# EAGLE schematic Avionis_Final_v19 (EAGLE 9.7.0)
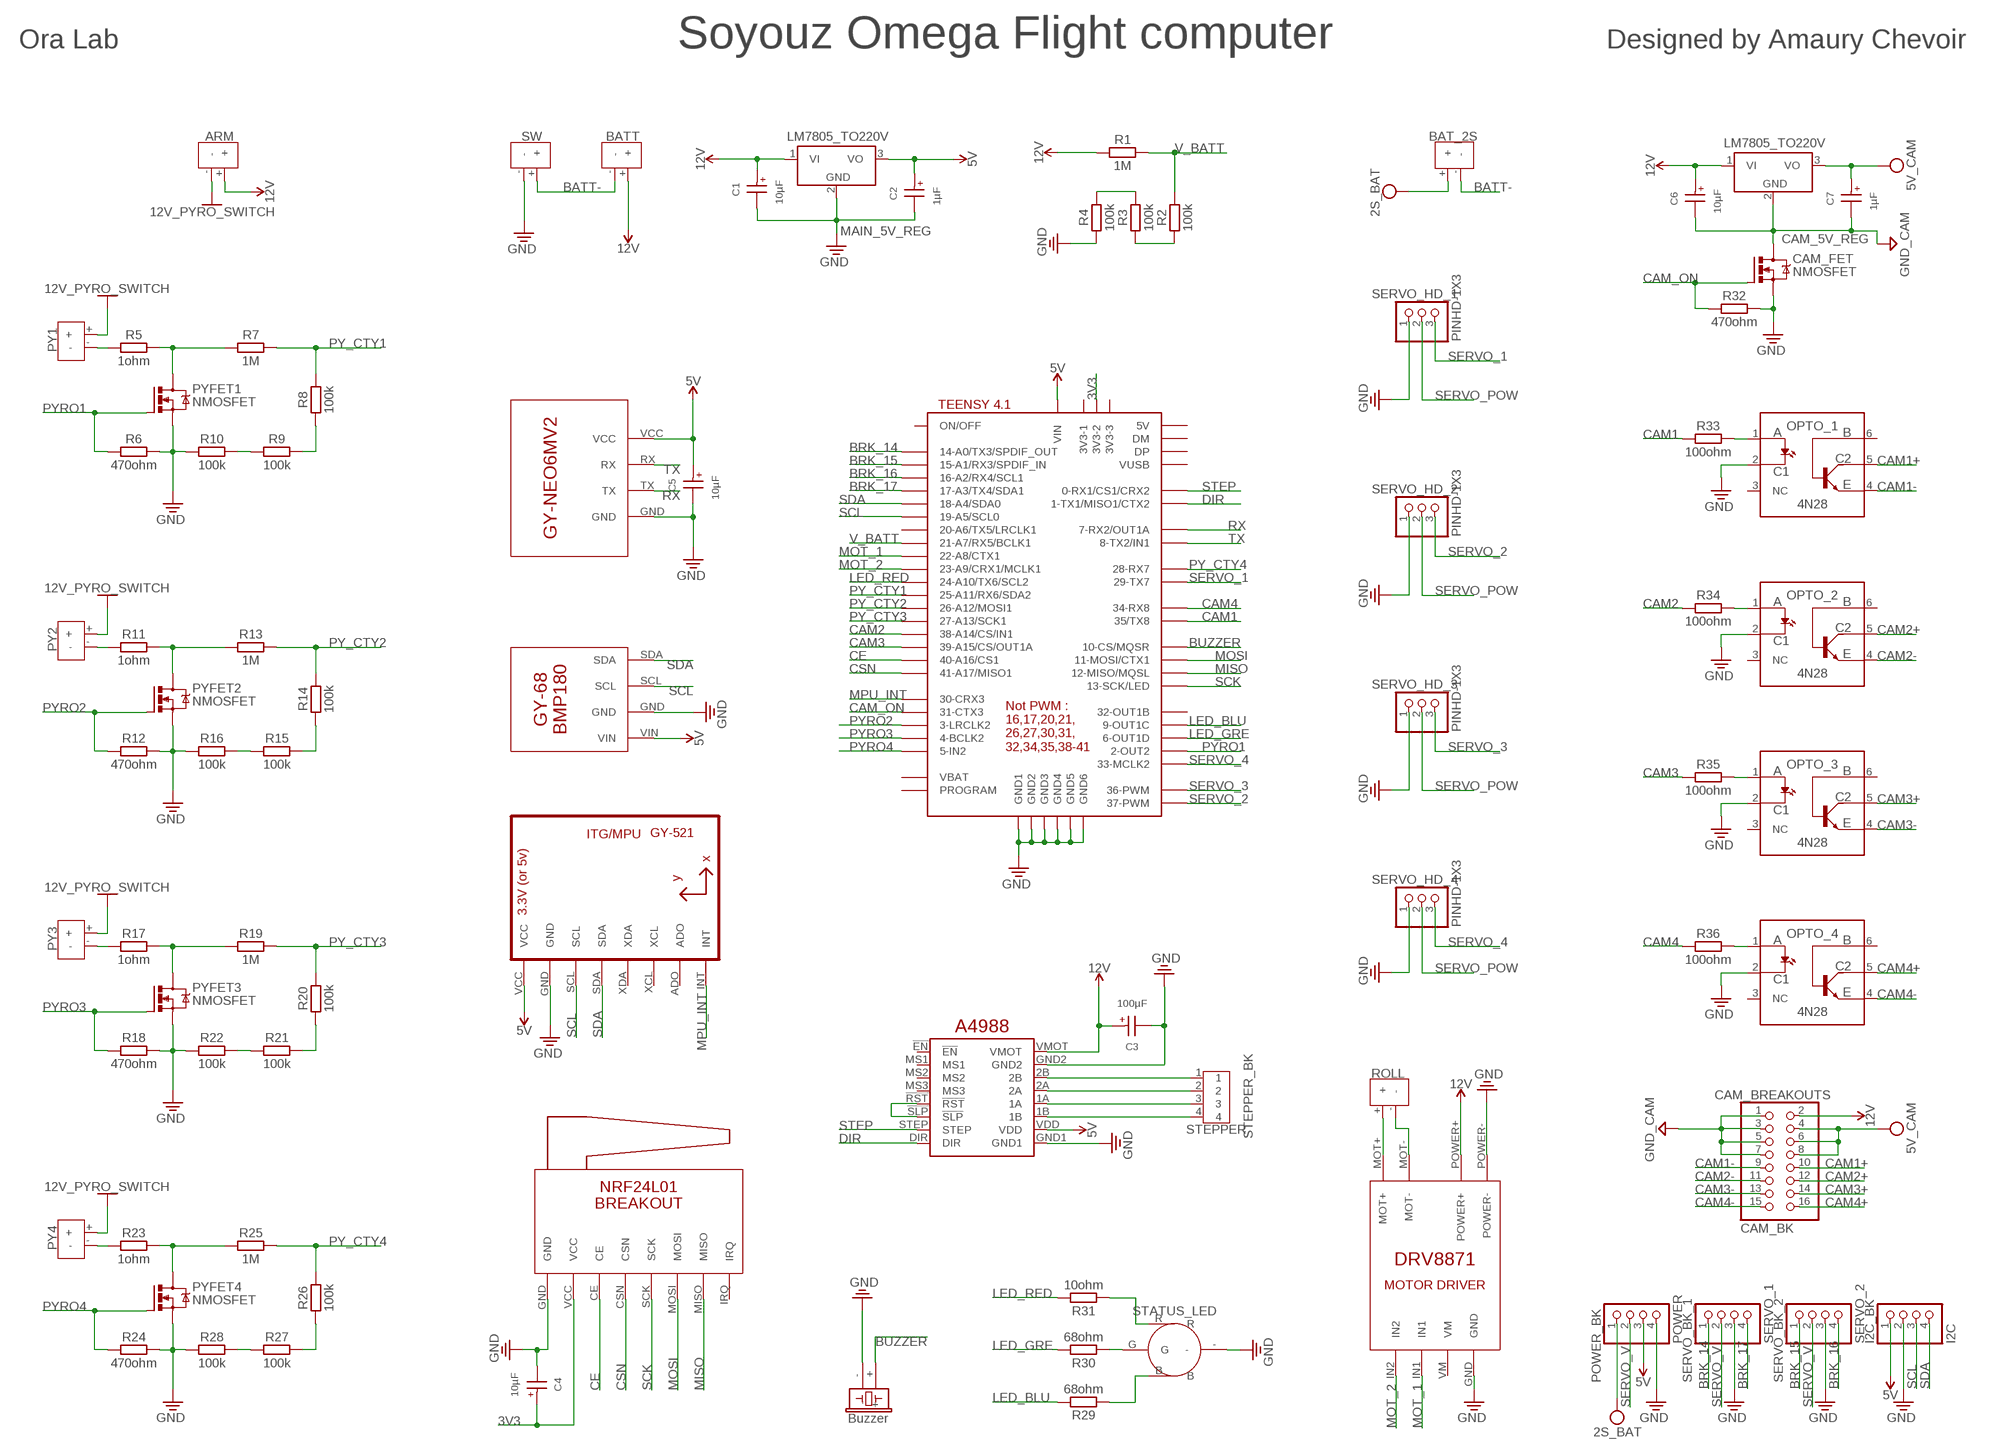
[diagram p0: schematic, sheet 1]

## Parts
ARM  TERMBLK_2  [TERMBLK_2_LOW]
BAT_2S  TERMBLK_2  [TERMBLK_2_LOW]
BATT  TERMBLK_2  [TERMBLK_2_LOW]
C1  10µF  WCAP-AT1H_5X11_860240672002  [WCAP-AT1H_5X11(DXL)]
C2  1µF  WCAP-AT1H_5X11_860240672002  [WCAP-AT1H_5X11(DXL)]
C3  100µF  WCAP-AT1H_5X11_860240672002  [WCAP-AT1H_5X11(DXL)]
C4  10µF  WCAP-AT1H_5X11_860240672002  [WCAP-AT1H_5X11(DXL)]
C5  10µF  WCAP-AT1H_5X11_860240672002  [WCAP-AT1H_5X11(DXL)]
C6  10µF  WCAP-AT1H_5X11_860240672002  [WCAP-AT1H_5X11(DXL)]
C7  1µF  WCAP-AT1H_5X11_860240672002  [WCAP-AT1H_5X11(DXL)]
CAM_5V_REG  LM7805_TO220V  [TO220V]
CAM_BREAKOUTS  CAM_BK  PINHD-2X8  [2X08]
CAM_FET  NMOSFET  NMOSFET_TO220  [TO220BV]
I2C_BK  I2C  PINHD-1X4  [1X04]
MAIN_5V_REG  LM7805_TO220V  [TO220V]
OPTO_1  4N28  [DIP762W60P254L712H480Q6B]
OPTO_2  4N28  [DIP762W60P254L712H480Q6B]
OPTO_3  4N28  [DIP762W60P254L712H480Q6B]
OPTO_4  4N28  [DIP762W60P254L712H480Q6B]
POWER_BK  POWER  PINHD-1X4  [1X04]
PY1  TERMBLK_2  [TERMBLK_2_LOW]
PY2  TERMBLK_2  [TERMBLK_2_LOW]
PY3  TERMBLK_2  [TERMBLK_2_LOW]
PY4  TERMBLK_2  [TERMBLK_2_LOW]
PYFET1  NMOSFET  NMOSFET_TO220  [TO220BV]
PYFET2  NMOSFET  NMOSFET_TO220  [TO220BV]
PYFET3  NMOSFET  NMOSFET_TO220  [TO220BV]
PYFET4  NMOSFET  NMOSFET_TO220  [TO220BV]
R1  1M  R_AXIAL-7.2MM-PITCH  [RESAD724W46L381D178B]
R2  100k  R_AXIAL-7.2MM-PITCH  [RESAD724W46L381D178B]
R3  100k  R_AXIAL-7.2MM-PITCH  [RESAD724W46L381D178B]
R4  100k  R_AXIAL-7.2MM-PITCH  [RESAD724W46L381D178B]
R5  1ohm  R_AXIAL-7.2MM-PITCH  [RESAD724W46L381D178B]
R6  470ohm  R_AXIAL-7.2MM-PITCH  [RESAD724W46L381D178B]
R7  1M  R_AXIAL-7.2MM-PITCH  [RESAD724W46L381D178B]
R8  100k  R_AXIAL-7.2MM-PITCH  [RESAD724W46L381D178B]
R9  100k  R_AXIAL-7.2MM-PITCH  [RESAD724W46L381D178B]
R10  100k  R_AXIAL-7.2MM-PITCH  [RESAD724W46L381D178B]
R11  1ohm  R_AXIAL-7.2MM-PITCH  [RESAD724W46L381D178B]
R12  470ohm  R_AXIAL-7.2MM-PITCH  [RESAD724W46L381D178B]
R13  1M  R_AXIAL-7.2MM-PITCH  [RESAD724W46L381D178B]
R14  100k  R_AXIAL-7.2MM-PITCH  [RESAD724W46L381D178B]
R15  100k  R_AXIAL-7.2MM-PITCH  [RESAD724W46L381D178B]
R16  100k  R_AXIAL-7.2MM-PITCH  [RESAD724W46L381D178B]
R17  1ohm  R_AXIAL-7.2MM-PITCH  [RESAD724W46L381D178B]
R18  470ohm  R_AXIAL-7.2MM-PITCH  [RESAD724W46L381D178B]
R19  1M  R_AXIAL-7.2MM-PITCH  [RESAD724W46L381D178B]
R20  100k  R_AXIAL-7.2MM-PITCH  [RESAD724W46L381D178B]
R21  100k  R_AXIAL-7.2MM-PITCH  [RESAD724W46L381D178B]
R22  100k  R_AXIAL-7.2MM-PITCH  [RESAD724W46L381D178B]
R23  1ohm  R_AXIAL-7.2MM-PITCH  [RESAD724W46L381D178B]
R24  470ohm  R_AXIAL-7.2MM-PITCH  [RESAD724W46L381D178B]
R25  1M  R_AXIAL-7.2MM-PITCH  [RESAD724W46L381D178B]
R26  100k  R_AXIAL-7.2MM-PITCH  [RESAD724W46L381D178B]
R27  100k  R_AXIAL-7.2MM-PITCH  [RESAD724W46L381D178B]
R28  100k  R_AXIAL-7.2MM-PITCH  [RESAD724W46L381D178B]
R29  68ohm  R_AXIAL-7.2MM-PITCH  [RESAD724W46L381D178B]
R30  68ohm  R_AXIAL-7.2MM-PITCH  [RESAD724W46L381D178B]
R31  10ohm  R_AXIAL-7.2MM-PITCH  [RESAD724W46L381D178B]
R32  470ohm  R_AXIAL-7.2MM-PITCH  [RESAD724W46L381D178B]
R33  100ohm  R_AXIAL-7.2MM-PITCH  [RESAD724W46L381D178B]
R34  100ohm  R_AXIAL-7.2MM-PITCH  [RESAD724W46L381D178B]
R35  100ohm  R_AXIAL-7.2MM-PITCH  [RESAD724W46L381D178B]
R36  100ohm  R_AXIAL-7.2MM-PITCH  [RESAD724W46L381D178B]
ROLL  TERMBLK_2  [TERMBLK_2_LOW]
SERVO_BK_1  SERVO_1  PINHD-1X4  [1X04]
SERVO_BK_2  SERVO_2  PINHD-1X4  [1X04]
SERVO_HD_1  PINHD-1X3  [1X03]
SERVO_HD_2  PINHD-1X3  [1X03]
SERVO_HD_3  PINHD-1X3  [1X03]
SERVO_HD_4  PINHD-1X3  [1X03]
STATUS_LED  LED_RGB_CAT_THT  [LED_RGB_CAT_THT]
STEPPER_BK  STEPPER  B4B-XH-A  [B4B-XH-A]
SW  TERMBLK_2  [TERMBLK_2_LOW]
U1  GY-521MPU6050  [GY-521]
U$1  TEENSY41-E  [TENNSY41-E]
U$2  NRF24L01_BREAKOUT  [NRF24L01_BREAKOUT]
U$3  GY-NEO6MV2  [GY-NEO6MV2]
U$4  GY-68_BMP180  [GY-68_BMP180]
U$5  DRV8871_MOTORDRIVER  [DRV8871_MOTORDRIVER]
U$6  A4988  [A4988]
U$7  BUZZER_12MM  [BUZZER-12MM-KIT]

## Nets
1A: STEPPER_BK.3 U$6.1A
1B: STEPPER_BK.4 U$6.1B
2A: STEPPER_BK.2 U$6.2A
2B: STEPPER_BK.1 U$6.2B
2S_BAT: BAT_2S.+ POWER_BK.1
3V3: C4.1(+) U$1.3V3-2 U$2.VCC
5V: C2.1(+) C5.1(+) I2C_BK.1 MAIN_5V_REG.3(VO) POWER_BK.3 U1.VCC U$1.VIN U$3.VCC U$4.VIN U$6.VDD
5V_CAM: C7.1(+) CAM_5V_REG.3(VO) CAM_BREAKOUTS.4 CAM_BREAKOUTS.6 CAM_BREAKOUTS.8
12V: ARM.+ BATT.+ C1.1(+) C3.1(+) C6.1(+) CAM_5V_REG.1(VI) CAM_BREAKOUTS.2 MAIN_5V_REG.1(VI) R1.1 U$5.POWER+ U$6.VMOT
12V_PYRO_SWITCH: ARM.- PY1.+ PY2.+ PY3.+ PY4.+
!RST: U$6.!RST U$6.!SLP
BATT-: BAT_2S.- BATT.- SW.+
BRK_14: SERVO_BK_1.1 U$1.14-A0/TX3/SPDIF_OUT
BRK_15: SERVO_BK_2.1 U$1.15-A1/RX3/SPDIF_IN
BRK_16: SERVO_BK_2.4 U$1.16-A2/RX4/SCL1
BRK_17: SERVO_BK_1.4 U$1.17-A3/TX4/SDA1
BUZZER: U$1.10-CS\MQSR(10-CS/MQSR) U$7.+
CAM1: R33.1 U$1.35-TX8(35/TX8)
CAM1+: CAM_BREAKOUTS.10 OPTO_1.5(C2)
CAM1-: CAM_BREAKOUTS.9 OPTO_1.4(E)
CAM2: R34.1 U$1.38-A14/CS/IN1
CAM2+: CAM_BREAKOUTS.12 OPTO_2.5(C2)
CAM2-: CAM_BREAKOUTS.11 OPTO_2.4(E)
CAM3: R35.1 U$1.39-A15/CS/OUT1A
CAM3+: CAM_BREAKOUTS.14 OPTO_3.5(C2)
CAM3-: CAM_BREAKOUTS.13 OPTO_3.4(E)
CAM4: R36.1 U$1.34-RX8
CAM4+: CAM_BREAKOUTS.16 OPTO_4.5(C2)
CAM4-: CAM_BREAKOUTS.15 OPTO_4.4(E)
CAM_ON: CAM_FET.G R32.1 U$1.31-CTX3
CE: U$1.40-A16/CS1 U$2.CE
CSN: U$1.41-A17/MISO1 U$2.CSN
DIR: U$1.1-TX1/MISO1/CTX2 U$6.DIR
GND: C1.2(-) C2.2(-) C3.2(-) C4.2(-) C5.2(-) CAM_FET.S I2C_BK.2 MAIN_5V_REG.2(GND) OPTO_1.2(C1) OPTO_2.2(C1) OPTO_3.2(C1) OPTO_4.2(C1) POWER_BK.4 PYFET1.S PYFET2.S PYFET3.S PYFET4.S R4.1 R6.2 R10.1 R12.2 R16.1 R18.2 R22.1 R24.2 R28.1 R32.2 SERVO_BK_1.3 SERVO_BK_2.3 SERVO_HD_1.1 SERVO_HD_2.1 SERVO_HD_3.1 SERVO_HD_4.1 STATUS_LED.- SW.- U1.GND U$1.GND1 U$1.GND2 U$1.GND3 U$1.GND4 U$1.GND5 U$1.GND6 U$2.GND U$3.GND U$4.GND U$5.GND U$5.POWER- U$6.GND1 U$6.GND2 U$7.-
GND_CAM: C6.2(-) C7.2(-) CAM_5V_REG.2(GND) CAM_BREAKOUTS.1 CAM_BREAKOUTS.3 CAM_BREAKOUTS.5 CAM_BREAKOUTS.7 CAM_FET.D
LED_BLU: R29.2 U$1.9-OUT1C
LED_GRE: R30.2 U$1.6-OUT1D
LED_RED: R31.2 U$1.24-A10/TX6/SCL2
MISO: U$1.12-MISO/MQSL U$2.MISO
MOSI: U$1.11-MOSI/CTX1 U$2.MOSI
MOT_1: U$1.22-A8/CTX1 U$5.IN1
MOT_2: U$1.23-A9/CRX1/MCLK1 U$5.IN2
MPU_INT: U1.INT U$1.30-CRX3
N$1: ROLL.+ U$5.MOT+
N$2: ROLL.- U$5.MOT-
N$3: PY2.- R11.1
N$4: PYFET2.D R11.2 R13.1
N$5: R15.1 R16.2
N$6: R14.1 R15.2
N$7: PY3.- R17.1
N$8: PY1.- R5.1
N$9: R9.1 R10.2
N$10: PYFET1.D R5.2 R7.1
N$11: R2.1 R3.1
N$12: R3.2 R4.2
N$13: R8.1 R9.2
N$14: PYFET3.D R17.2 R19.1
N$15: R21.1 R22.2
N$16: R20.1 R21.2
N$17: PY4.- R23.1
N$18: PYFET4.D R23.2 R25.1
N$19: R27.1 R28.2
N$20: R26.1 R27.2
N$21: R30.1 STATUS_LED.G
N$22: R31.1 STATUS_LED.R
N$23: OPTO_1.1(A) R33.2
N$24: R29.1 STATUS_LED.B
N$25: OPTO_2.1(A) R34.2
N$26: OPTO_3.1(A) R35.2
N$27: OPTO_4.1(A) R36.2
PY_CTY1: R7.2 R8.2 U$1.25-A11/RX6/SDA2
PY_CTY2: R13.2 R14.2 U$1.26-A12/MOSI1
PY_CTY3: R19.2 R20.2 U$1.27-A13/SCK1
PY_CTY4: R25.2 R26.2 U$1.28-RX7
PYRO1: PYFET1.G R6.1 U$1.2-OUT2
PYRO2: PYFET2.G R12.1 U$1.3-LRCLK2
PYRO3: PYFET3.G R18.1 U$1.4-BCLK2
PYRO4: PYFET4.G R24.1 U$1.5-IN2
RX: U$1.7-RX2/OUT1A U$3.TX
SCK: U$1.13-SCK/LED U$2.SCK
SCL: I2C_BK.3 U1.SCL U$1.19-A5/SCL0 U$4.SCL
SDA: I2C_BK.4 U1.SDA U$1.18-A4/SDA0 U$4.SDA
SERVO_1: SERVO_HD_1.3 U$1.29-TX7
SERVO_2: SERVO_HD_2.3 U$1.37-PWM
SERVO_3: SERVO_HD_3.3 U$1.36-PWM
SERVO_4: SERVO_HD_4.3 U$1.33-MCLK2
SERVO_POW: SERVO_HD_1.2 SERVO_HD_2.2 SERVO_HD_3.2 SERVO_HD_4.2
SERVO_V: POWER_BK.2 SERVO_BK_1.2 SERVO_BK_2.2
STEP: U$1.0-RX1/CS1/CRX2 U$6.STEP
TX: U$1.8-TX2/IN1 U$3.RX
V_BATT: R1.2 R2.2 U$1.21-A7/RX5/BCLK1
Unconnected: OPTO_1.3(NC) OPTO_1.6(B) OPTO_2.3(NC) OPTO_2.6(B) OPTO_3.3(NC) OPTO_3.6(B) OPTO_4.3(NC) OPTO_4.6(B) U1.ADO U1.XCL U1.XDA U$1.3V3-1 U$1.3V3-3 U$1.20-A6/TX5/LRCLK1 U$1.32-OUT1B U$1.+5V(5V) U$1.DM U$1.DP U$1.ON/OFF U$1.PROGRAM U$1.VBAT U$1.VUSB U$2.IRQ U$5.VM U$6.!EN U$6.MS1 U$6.MS2 U$6.MS3

## Notes on the sheet
- Ora Lab | Soyouz Omega Flight computer | Designed by Amaury Chevoir

## Library data of the parts
ARM BAT_2S BATT PY1-PY4 ROLL SW = TERMINAL BLOCK:TERMBLK_2
C1-C7 = Wurth_Capacitors_WCAP-AT1H:WCAP-AT1H_5X11: WCAP-AT1H Aluminium Electrolytic Capacitors Long Life +105 °C Characteristics Long life product series Mounting style: THT Radial Capacitance range: 6.8 µF ‒ 3300 µF Capacitance tolerance: ±20 % Voltage range (UR): 10 ‒ 450 V(DC) Operating temperature: -40 °C up to +105 °C for UR ≤100 V(DC) -25 °C up to +105 °C for UR > 100 V(DC) Endurance: 5000 ‒ 10000 h @ +105 °C Dimensions (DxL) in mm: 5.0 x 11.0 up to 18.0 x 35.5 Recommended soldering: Wave soldering Applications Long life applications (industry, medical) Filtering Smoothing Energy storage Coupling e.g. Switched-mode power supply, AC/DC converter, adapter, charger, digital camera <https://www.we-online.com/catalog/media/o14727v209%20Family_WCAP-AT1H.jpg> Details see: https://www.we-online.com/catalog/en/WCAP-AT1H/ Updated by yingchun,Shan;2020-02-28 2020(C) Würth Elektronik; DATASHEET-URL: https://www.we-online.com/catalog/datasheet/860240672002.pdf; DF: 10%; DIAMETER: 5mm; I-LEAK: 5uA; I-RIPPLE: 97mA; L: 11mm; OPERATING-TEMPERATURE: -40 °C up to +105 °C; PART-NUMBER: 860240672002; PITCH: 2mm; TECHNICAL-REFERENCE: ATDC110100M050DSPA3E000; VALUE: 10 µF; VR: 50V(DC)
CAM_5V_REG MAIN_5V_REG = IC_Power-Management:LM7805: 5V Voltage Regulator Reference Datasheet <https://www.ti.com/lit/ds/symlink/lm340.pdf>; CATEGORY: IC_Linear; DESCRIPTION: 5V Voltage Regulator; MANUFACTURER: Generic; MPN: Generic; SERIES: LM7805; SUB-CATEGORY: Voltage Regulator; TYPE: 5V
CAM_BREAKOUTS = My connectors:PINHD-2X8: PIN HEADER; CATEGORY: Headers; DESCRIPTION: Header, Straight, 2x8 Position; MANUFACTURER: Generic; MPN: Generic; OPERATING_TEMPERATURE: Generic; PART_STATUS: Active; PITCH: 0.100" (2.54mm); ROHS_COMPLIANCE: Generic; SERIES: Generic; SUB-CATEGORY: Headers, Male Pins; TYPE: Board to Board or Cable, Unshrouded, Through Hole, Straight
CAM_FET PYFET1-PYFET4 = Transistor:NMOSFET: N-Channel MOSFET - Generic; CATEGORY: Transistor; SUB-CATEGORY: MOSFET; TYPE: N-Channel
I2C_BK POWER_BK SERVO_BK_1 SERVO_BK_2 = My connectors:PINHD-1X4: PIN HEADER; CATEGORY: Headers; DESCRIPTION: Header, Straight, 4 Position; MANUFACTURER: Generic; MPN: Generic; OPERATING_TEMPERATURE: Generic; PART_STATUS: Active; PITCH: 0.100" (2.54mm); ROHS_COMPLIANCE: Generic; SERIES: Generic; SUB-CATEGORY: Headers, Male Pins; TYPE: Board to Board or Cable, Unshrouded, Through Hole, Straight
OPTO_1-OPTO_4 = Opto-Electronic:4N: Optocoupler, Phototransistor Output, with Base Connection Datasheet <https://www.vishay.com/docs/83725/4n25.pdf>; CATEGORY: Opto-Electronic; DESCRIPTION: Optoisolator Transistor with Base Output 5000Vrms Channel 6-DIP; MANUFACTURER: Vishay; MPN: 4N28; OPERATING_TEMP: - 55°C to + 100 °C; PART_STATUS: Active; ROHS_COMPLIANT: COMPLIANT; SERIES: 4N2x; SUB-CATEGORY: Optocoupler; THERMALLOSS: 0.150 W
R1-R36 = My Resistors and Pot:R: Resistor Fixed - Generic; CATEGORY: Resistor; SUB-CATEGORY: Fixed
SERVO_HD_1-SERVO_HD_4 = My connectors:PINHD-1X3: PIN HEADER; CATEGORY: Headers; DESCRIPTION: Header, Straight, 3 Position; MANUFACTURER: Generic; MPN: Generic; OPERATING_TEMPERATURE: Generic; PART_STATUS: Active; PITCH: 0.100" (2.54mm); ROHS_COMPLIANCE: Generic; SERIES: Generic; SUB-CATEGORY: Headers, Male Pins; TYPE: Board to Board or Cable, Unshrouded, Through Hole, Straight
STATUS_LED = LED_RGB_CAT:LED_RGB_CAT_THT
STEPPER_BK = My connectors:B4B-XH-A: XH Connector Top Entry - 4POS Details see: Datasheet <http://www.jst-mfg.com/product/pdf/eng/eXH.pdf>; CATEGORY: Header; DSECRIPTION: Connector Header Through Hole 4 position 0.098" (2.50mm); MANUFACTURER: JST Sales America Inc.; MPN: B4B-XH-A(LF)(SN); OPERATING_TEMPERATURE: -25 C to 85 C; PART_STATUS: ACTIVE; PITCH: 0.098" (2.50mm); ROHS_COMPLIANCE: ROHS3 Compliant; SERIES: XH; SUB_CATEGORY: Rectangular Connectors; TYPE: Header, Male Pin, Board to Cable/Wire, Through Hole
U1 = GY-521_MPU6050:GY-521
U$1 = TEENSY41:TEENSY41-E
U$2 = NRF24L01_BREAKOUT:NRF24L01_BREAKOUT
U$3 = GY-NEO6MV2:GY-NEO6MV2
U$4 = GY-68_BMP180:GY-68_BMP180
U$5 = DRV8871_MOTORDRIVER:DRV8871_MOTORDRIVER
U$6 = A4988:A4988
U$7 = Buzzer 12mm Ora:BUZZER_12MM